# EAGLE design arduino_8i_8o_Shield (EAGLE 7.3.0)
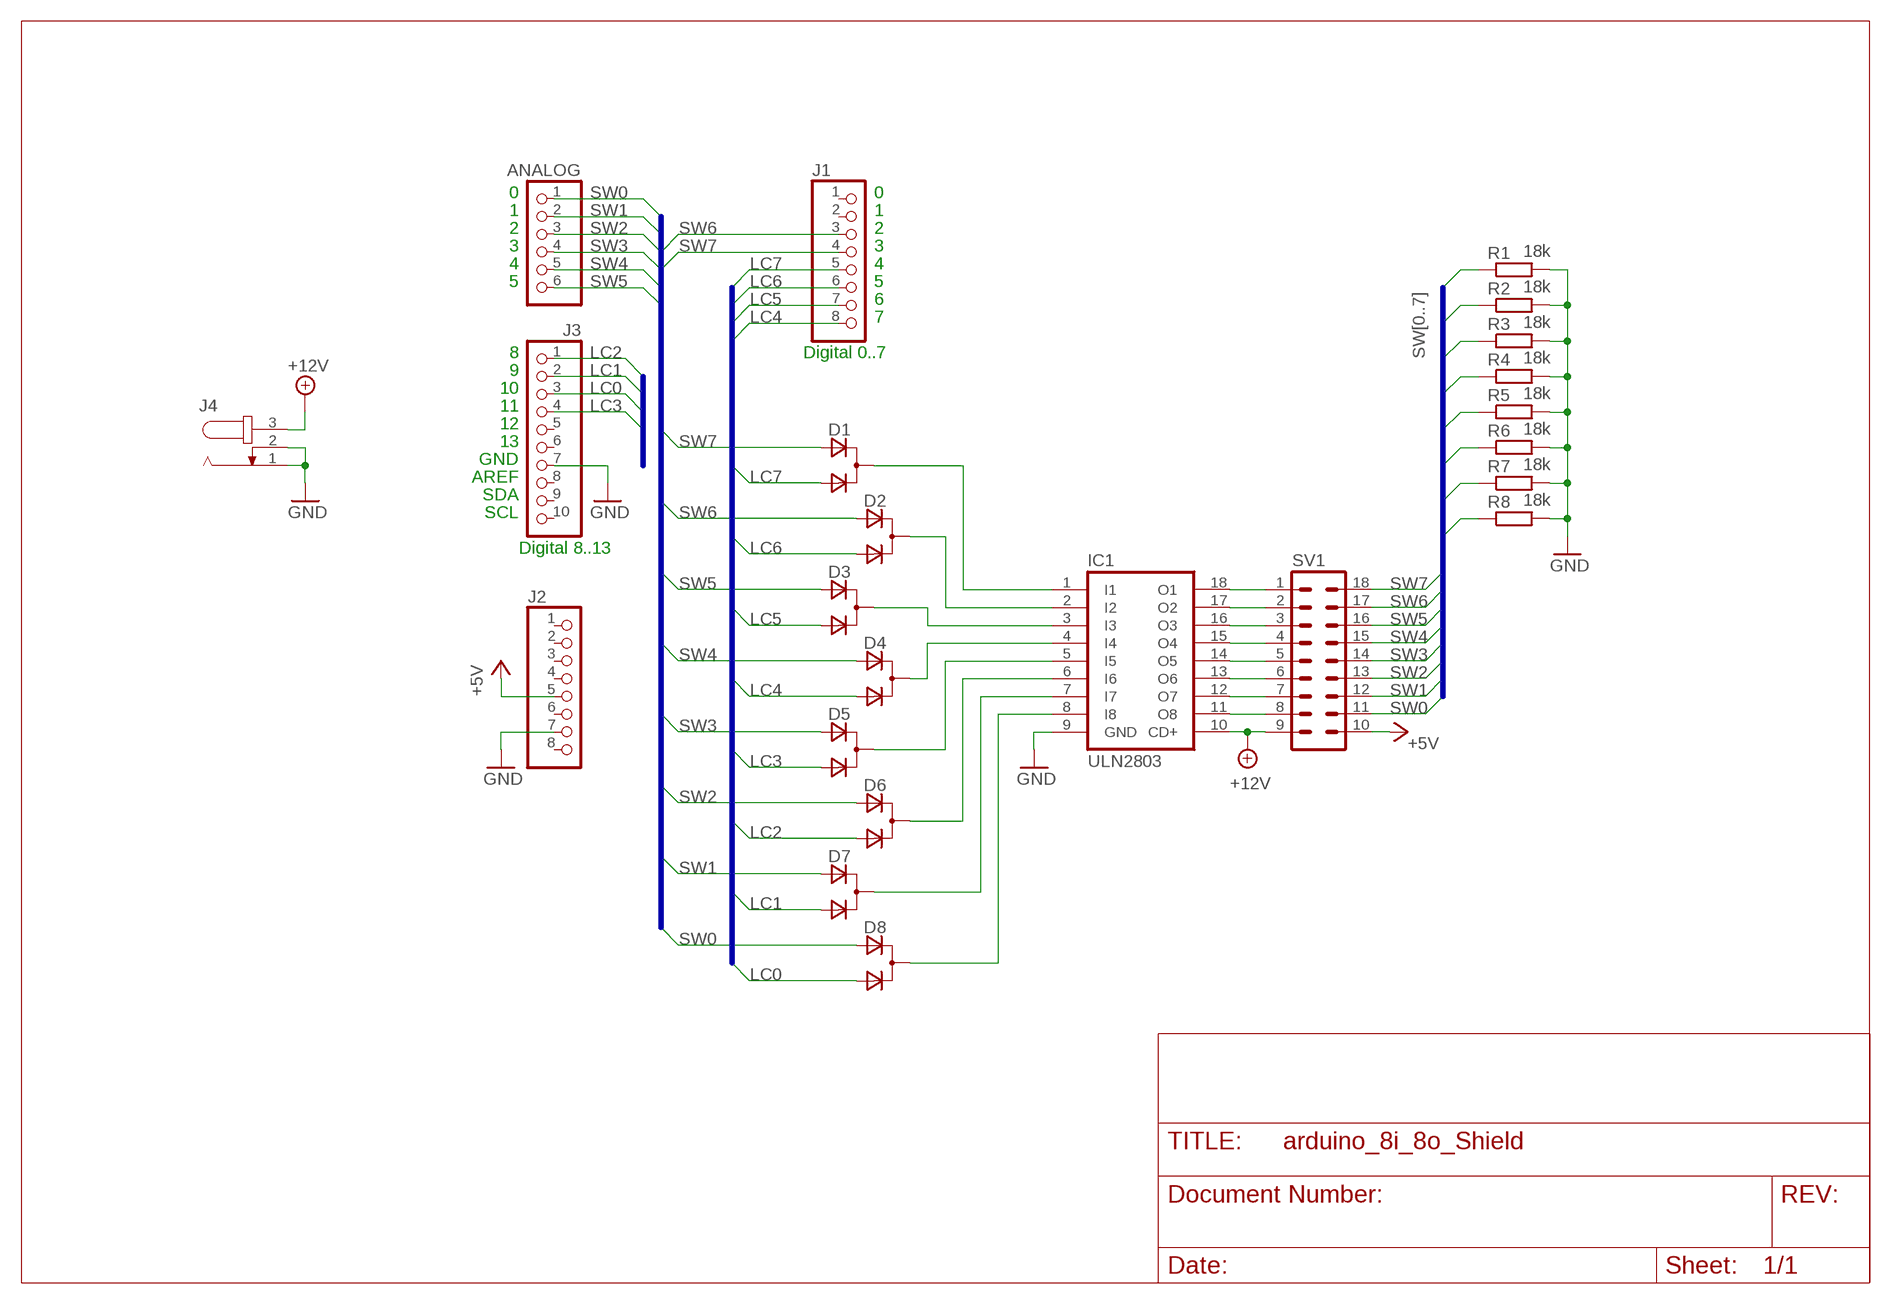
[diagram p0: schematic, sheet 1]

## Parts
ANALOG  PINHD-1X6  [1X06]
D1  VAR2_SOT23  [SOT-23]
D2  VAR2_SOT23  [SOT-23]
D3  VAR2_SOT23  [SOT-23]
D4  VAR2_SOT23  [SOT-23]
D5  VAR2_SOT23  [SOT-23]
D6  VAR2_SOT23  [SOT-23]
D7  VAR2_SOT23  [SOT-23]
D8  VAR2_SOT23  [SOT-23]
IC1  ULN2803  ULN2803A  [DIL18]
J1  PINHD-1X8TH  [1X08-TH]
J2  PINHD-1X8TH  [1X08-TH]
J3  PINHD-1X10TH  [1X10-TH]
J4  JACK-PLUG0  [SPC4077]
R1  18k  R-EU_M1206  [M1206]
R2  18k  R-EU_M1206  [M1206]
R3  18k  R-EU_M1206  [M1206]
R4  18k  R-EU_M1206  [M1206]
R5  18k  R-EU_M1206  [M1206]
R6  18k  R-EU_M1206  [M1206]
R7  18k  R-EU_M1206  [M1206]
R8  18k  R-EU_M1206  [M1206]
SV1  IC18PL  [IC18PL]

## Nets
+5V: J2.5 SV1.10
+12V: IC1.10(CD+) J4.3 SV1.9
GND: IC1.9(GND) J2.7 J3.7 J4.1 J4.2 R1.2 R2.2 R3.2 R4.2 R5.2 R6.2 R7.2 R8.2
LC0: D8.3(A2) J3.3
LC1: D7.3(A2) J3.2
LC2: D6.3(A2) J3.1
LC3: D5.3(A2) J3.4
LC4: D4.3(A2) J1.8
LC5: D3.3(A2) J1.7
LC6: D2.3(A2) J1.6
LC7: D1.3(A2) J1.5
N$1: IC1.11(O8) SV1.8
N$2: IC1.18(O1) SV1.1
N$3: IC1.17(O2) SV1.2
N$4: IC1.16(O3) SV1.3
N$5: IC1.15(O4) SV1.4
N$6: IC1.14(O5) SV1.5
N$7: IC1.13(O6) SV1.6
N$8: IC1.12(O7) SV1.7
N$9: D1.1(C) IC1.1(I1)
N$10: D2.1(C) IC1.2(I2)
N$11: D3.1(C) IC1.3(I3)
N$12: D4.1(C) IC1.4(I4)
N$13: D5.1(C) IC1.5(I5)
N$14: D6.1(C) IC1.6(I6)
N$15: D7.1(C) IC1.7(I7)
N$16: D8.1(C) IC1.8(I8)
SW0: ANALOG.1 D8.2(A1) R1.1 SV1.11
SW1: ANALOG.2 D7.2(A1) R2.1 SV1.12
SW2: ANALOG.3 D6.2(A1) R3.1 SV1.13
SW3: ANALOG.4 D5.2(A1) R4.1 SV1.14
SW4: ANALOG.5 D4.2(A1) R5.1 SV1.15
SW5: ANALOG.6 D3.2(A1) R6.1 SV1.16
SW6: D2.2(A1) J1.3 R7.1 SV1.17
SW7: D1.2(A1) J1.4 R8.1 SV1.18
Unconnected: J1.1 J1.2 J2.1 J2.2 J2.3 J2.4 J2.6 J2.8 J3.5 J3.6 J3.8 J3.9 J3.10

## Buses
SW[0..7]
LC[0..7]

## Notes on the sheet
- 0 | 0
- 1 | 1
- 2 | 2
- 3 | 3
- 4 | 4
- 5 | 5
- 6
- 7
- 8 | Digital 0..7
- 9
- 10
- 11
- 12
- 13
- GND
- AREF
- SDA
- SCL
- Digital 8..13

## Library data of the parts
ANALOG = pinhead:PINHD-1X6: PIN HEADER
D1-D8 = zetex:VAR2_SOT23: Dual DIODE; OC_FARNELL: unknown; OC_NEWARK: unknown
IC1 = uln-udn:ULN2803A: DRIVER ARRAY
J1 J2 = SmartPrj:PINHD-1X8: PIN HEADER
J3 = SmartPrj:PINHD-1X10: PIN HEADER
J4 = con-jack:JACK-PLUG: DC POWER JACK Power Jack, DC, Right Angle, Through Hole, Rated 5A at 16VDC, PC Terminals Distributor: Farnell (www.Farnell.de) Drawing: 84N1161.pdf / 84N1162.pdf Manufacturer: SPC Technology (www.spctechnology.com) Type: SPC4077 / SPC 4078; OC_FARNELL: unknown; OC_NEWARK: unknown
R1-R8 = rcl:R-EU_: RESISTOR, European symbol
SV1 = con-dil:IC18PL: DIL CABLE CONNECTOR

## Board
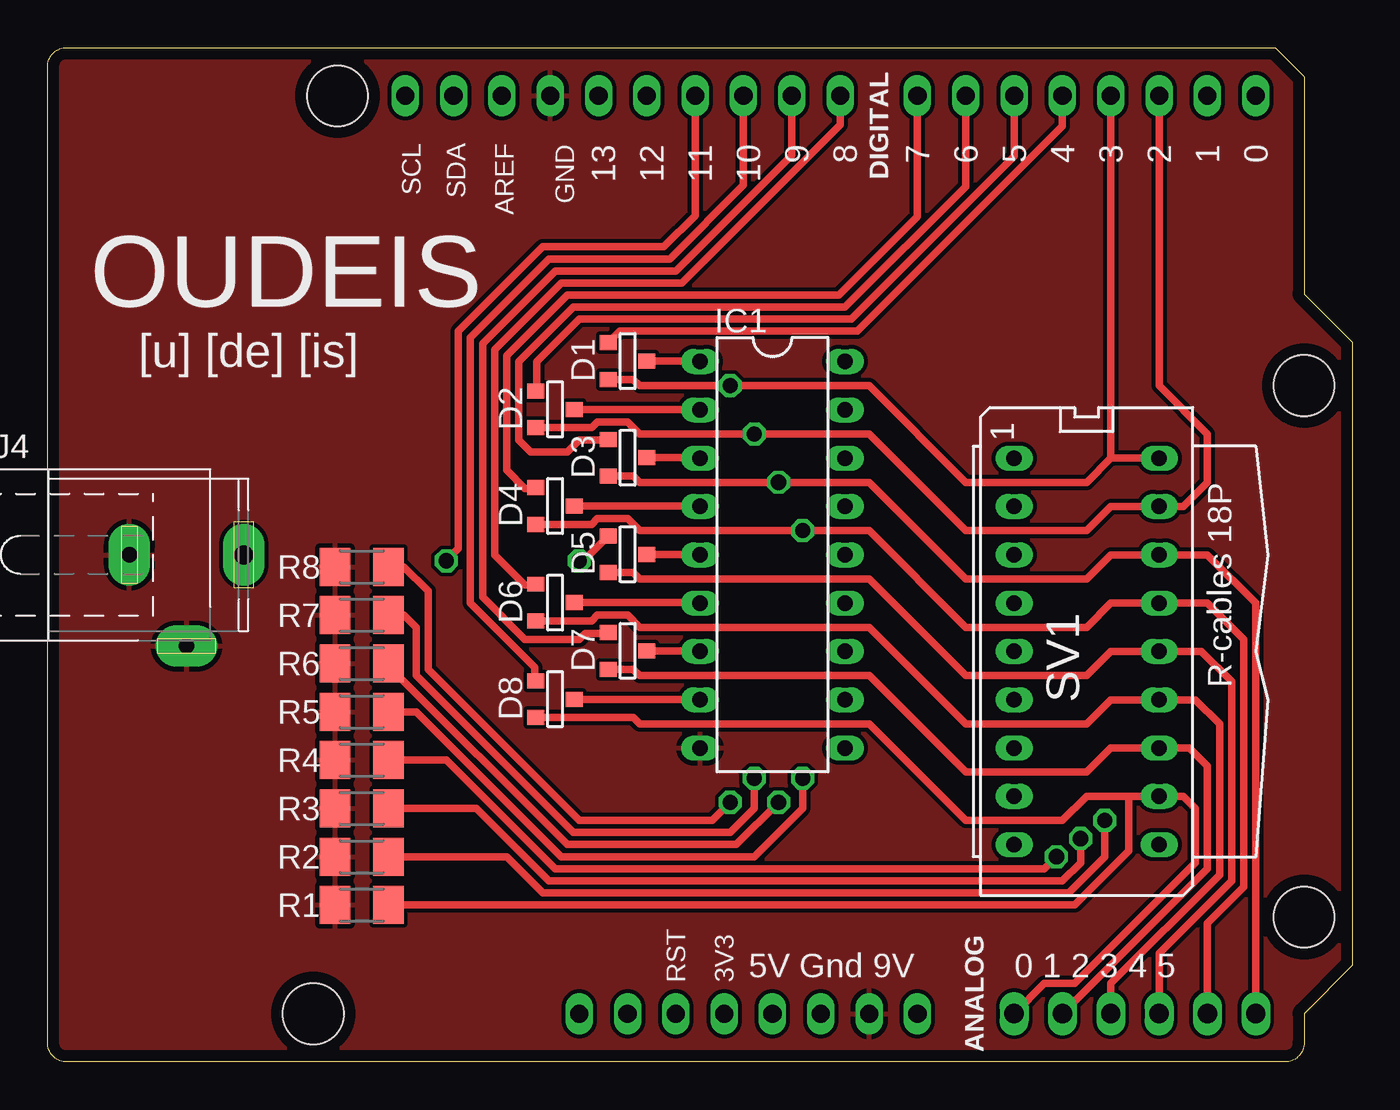
[diagram p1: board, top side]
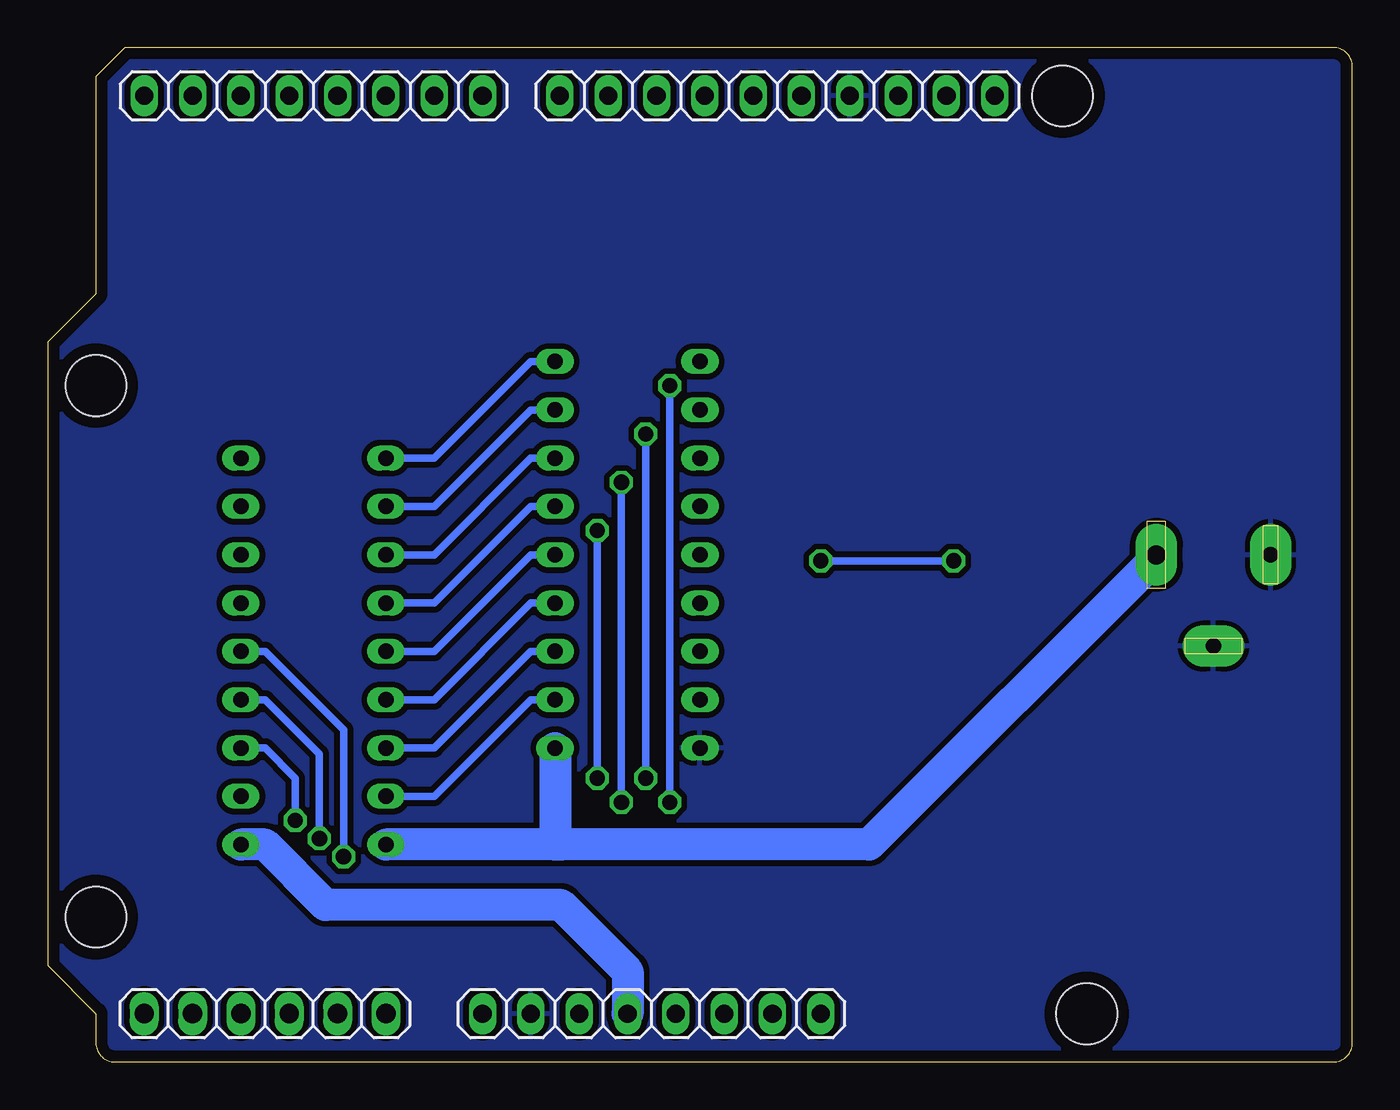
[diagram p2: board, bottom side, seen from below]

Size 68.58 x 53.34 mm. Coordinates in mm from the lower left corner, seen from the top.
Outline: 64.52,53.34 66.04,51.82 66.04,40.39 68.58,37.85 68.58,5.08 66.04,2.54 66.04,1 arc-90 65.04,0 1,0 arc-90 0,1 0,52.34 arc-90 1,53.34 64.52,53.34
Copper layers (1*16): Top 0.035mm / dielectric 1.5mm / Bottom 0.035mm
Design rules "default *": minimum track width 10mil, minimum drill 24mil, track to track 8mil, track to pad 8mil, pad to pad 8mil, via to via 8mil, smd to smd 8mil, copper to edge 24mil, drill to drill 8mil, minimum pad ring 10mil, minimum via ring 8mil, stop-mask expansion 2mil, vias tented up to drill 0mil, thermal gap 10mil
Holes 3.2 mm at 15.24,50.8 66.04,7.62 66.04,35.56 13.97,2.54

### Footprints (pad centres in the part's own frame; a part is rotated, then mirrored left to right if it is on the bottom)
1X06 = drill 1.016 long: 1 -6.35,0; 2 -3.81,0; 3 -1.27,0; 4 1.27,0; 5 3.81,0; 6 6.35,0
SOT-23 = smd 0.787 x 0.889: 1 0.025,-1.016; 2 -0.94,1.016; 3 0.991,1.016
DIL18 = drill 0.813 long: 1 -10.16,-3.81; 2 -7.62,-3.81; 3 -5.08,-3.81; 4 -2.54,-3.81; 5 0,-3.81; 6 2.54,-3.81; 7 5.08,-3.81; 8 7.62,-3.81; 9 10.16,-3.81; 10 10.16,3.81; 11 7.62,3.81; 12 5.08,3.81; 13 2.54,3.81; 14 0,3.81; 15 -2.54,3.81; 16 -5.08,3.81; 17 -7.62,3.81; 18 -10.16,3.81
1X08-TH = drill 0.95 pad 1.422 long: 1 -8.89,0; 2 -6.35,0; 3 -3.81,0; 4 -1.27,0; 5 1.27,0; 6 3.81,0; 7 6.35,0; 8 8.89,0
1X10-TH = drill 0.95 pad 1.422 long: 1 -11.43,0; 2 -8.89,0; 3 -6.35,0; 4 -3.81,0; 5 -1.27,0; 6 1.27,0; 7 3.81,0; 8 6.35,0; 9 8.89,0; 10 11.43,0
SPC4077 = drill 0.8 pad 2.184 long: 1 -3,0; 2 0,-4.8 | drill 1 pad 2.184 long: 3 3,0
M1206 = smd 1.6 x 2: 1 -1.4,0; 2 1.4,0
IC18PL = drill 0.813 long: 1 -10.16,-3.81; 2 -7.62,-3.81; 3 -5.08,-3.81; 4 -2.54,-3.81; 5 0,-3.81; 6 2.54,-3.81; 7 5.08,-3.81; 8 7.62,-3.81; 9 10.16,-3.81; 10 10.16,3.81; 11 7.62,3.81; 12 5.08,3.81; 13 2.54,3.81; 14 0,3.81; 15 -2.54,3.81; 16 -5.08,3.81; 17 -7.62,3.81; 18 -10.16,3.81

### Placement (x,y rotation side)
ANALOG  57.15,2.54 180 bottom
D1  30.48,36.83 90 top
D2  26.67,34.29 90 top
D3  30.48,31.75 90 top
D4  26.67,29.21 90 top
D5  30.48,26.67 90 top
D6  26.67,24.13 90 top
D7  30.48,21.59 90 top
D8  26.67,19.05 90 top
IC1  38.1,26.67 270 top
J1  54.61,50.8 0 bottom
J2  36.83,2.54 180 bottom
J3  30.23,50.8 0 bottom
J4  7.3,26.67 0 top
R1  16.51,8.26 180 top
R2  16.51,10.79 180 top
R3  16.51,13.34 180 top
R4  16.51,15.88 180 top
R5  16.51,18.41 180 top
R6  16.51,20.95 180 top
R7  16.51,23.5 180 top
R8  16.51,26.04 180 top
SV1  54.61,21.59 270 top

### Tracks (layer width: path | path; a pad name or v marks a point on that pad's centre or on a via)
+5V
  Bottom 1.676: SV1.10 57.15,11.43 53.98,8.26 41.59,8.26 38.1,4.76 J2.5
+12V
  Bottom 1.676: SV1.9 41.91,11.43 41.91,11.75 | IC1.10 41.91,11.75 | J4.3 10.16,26.67 25.4,11.43 41.59,11.43 41.91,11.75
GND
  pour Bottom (isolate 0.305): 0,53.34 68.58,53.34 68.58,0 0,0
  pour Top: 0,53.34 68.58,53.34 68.58,0 0,0
LC0
  Top 0.406: D8.3 25.62,20 25.62,20.74 22.23,24.13 22.23,38.1 26.35,42.23 32.7,42.23 36.58,46.1 J3.3
LC1
  Top 0.406: J3.2 39.12,47.69 33.02,41.59 26.67,41.59 22.86,37.78 22.86,24.45 25.08,22.23 27.94,22.23 28.26,22.54 29.43,22.54 D7.3
LC2
  Top 0.406: J3.1 41.66,49.28 33.34,40.96 26.99,40.96 23.5,37.47 23.5,26.67 25.08,25.08 25.62,25.08 D6.3
LC3  (via drill 0.8)
  Top 0.406: J3.4 34.04,44.51 32.38,42.86 26.04,42.86 21.59,38.42 21.59,26.99 v20.95,26.35 | v27.94,26.35 28.16,26.35 D5.3
  Bottom 0.406: v20.95,26.35 v27.94,26.35
LC4
  Top 0.406: D4.3 25.62,30.16 25.08,30.16 24.13,31.11 24.13,37.15 27.3,40.32 41.59,40.32 45.72,44.45 J1.8
LC5
  Top 0.406: D3.3 29.43,32.7 27.94,32.7 27.3,32.07 25.4,32.07 24.77,32.7 24.77,36.83 27.62,39.69 41.91,39.69 48.26,46.04 J1.7
LC6
  Top 0.406: J1.6 50.8,47.62 42.23,39.05 27.94,39.05 25.72,36.83 25.72,35.34 D2.3
LC7
  Top 0.406: D1.3 30.06,38.42 42.55,38.42 53.34,49.21 J1.5
N$1
  Bottom 0.406: IC1.11 43.18,19.05 48.26,13.97 SV1.8
N$2
  Bottom 0.406: IC1.18 43.18,36.83 48.26,31.75 SV1.1
N$3
  Bottom 0.406: IC1.17 43.18,34.29 48.26,29.21 SV1.2
N$4
  Bottom 0.406: IC1.16 43.18,31.75 48.26,26.67 SV1.3
N$5
  Bottom 0.406: IC1.15 43.18,29.21 48.26,24.13 SV1.4
N$6
  Bottom 0.406: IC1.14 43.18,26.67 48.26,21.59 SV1.5
N$7
  Bottom 0.406: IC1.13 43.18,24.13 48.26,19.05 SV1.6
N$8
  Bottom 0.406: IC1.12 43.18,21.59 48.26,16.51 SV1.7
N$9
  Top 0.406: D1.1 34.29,36.85 IC1.1
N$10
  Top 0.406: D2.1 34.29,34.31 IC1.2
N$11
  Top 0.406: D3.1 34.29,31.77 IC1.3
N$12
  Top 0.406: D4.1 34.29,29.23 IC1.4
N$13
  Top 0.406: D5.1 34.29,26.7 IC1.5
N$14
  Top 0.406: D6.1 34.29,24.16 IC1.6
N$15
  Top 0.406: D7.1 34.29,21.61 IC1.7
N$16
  Top 0.406: D8.1 34.29,19.07 IC1.8
SW0
  Top 0.406: D8.2 30.79,18.11 31.11,17.78 43.18,17.78 48.26,12.7 53.34,12.7 54.61,13.97 56.83,13.97 | 56.83,13.97 SV1.11 59.69,13.97 60.33,13.34 60.33,10.48 53.98,4.13 52.39,4.13 ANALOG.1 | R1.1 53.98,8.26 56.83,11.11 56.83,13.97
SW1  (via drill 0.8)
  Top 0.406: D7.2 30.79,20.65 31.11,20.32 43.18,20.32 48.26,15.24 54.61,15.24 55.88,16.51 SV1.12 60.01,16.51 60.96,15.56 60.96,10.16 ANALOG.2 | R2.1 24.13,10.79 26.04,8.89 53.66,8.89 55.56,10.79 v55.56,12.7
  Bottom 0.406: v55.56,12.7 55.56,14.92 57.15,16.51 SV1.12
SW2  (via drill 0.8)
  Top 0.406: D6.2 28.59,23.19 28.89,23.5 30.48,23.5 31.11,22.86 43.18,22.86 48.26,17.78 54.61,17.78 55.88,19.05 SV1.13 60.33,19.05 61.59,17.78 61.59,9.84 55.88,4.13 ANALOG.3 | R3.1 22.54,13.34 26.35,9.53 53.34,9.53 54.29,10.48 v54.29,11.75
  Bottom 0.406: v54.29,11.75 54.29,16.19 57.15,19.05 SV1.13
SW3  (via drill 0.8)
  Top 0.406: D5.2 30.79,25.73 31.11,25.4 43.18,25.4 48.26,20.32 54.61,20.32 55.88,21.59 SV1.14 60.64,21.59 62.23,20 62.23,9.53 58.42,5.71 ANALOG.4 | R4.1 20.95,15.88 26.67,10.16 52.39,10.16 v53.02,10.79
  Bottom 0.406: v53.02,10.79 53.02,17.46 57.15,21.59 SV1.14
SW4  (via drill 0.8)
  Top 0.406: D4.2 28.59,28.27 28.89,28.57 30.48,28.57 31.11,27.94 v39.69,27.94 43.18,27.94 48.26,22.86 54.61,22.86 55.88,24.13 SV1.15 60.96,24.13 62.87,22.23 62.87,9.21 60.96,7.3 ANALOG.5 | R5.1 19.37,18.41 26.99,10.79 37.15,10.79 39.69,13.34 v39.69,14.92
  Bottom 0.406: v39.69,14.92 v39.69,27.94
SW5  (via drill 0.8)
  Top 0.406: D3.2 30.79,30.81 31.11,30.48 v38.42,30.48 43.18,30.48 48.26,25.4 54.61,25.4 55.88,26.67 SV1.16 60.96,26.67 63.5,24.13 ANALOG.6 | R6.1 17.91,20.82 27.3,11.43 36.2,11.43 v38.42,13.65
  Bottom 0.406: v38.42,13.65 v38.42,30.48
SW6  (via drill 0.8)
  Top 0.406: D2.2 28.59,33.35 28.89,33.66 30.48,33.66 31.11,33.02 v37.15,33.02 43.18,33.02 48.26,27.94 54.61,27.94 55.88,29.21 SV1.17 59.69,29.21 60.96,30.48 60.96,33.02 58.42,35.56 J1.3 | R7.1 18.73,23.5 19.37,22.86 19.37,20.32 27.62,12.06 35.88,12.06 37.15,13.34 v37.15,14.92
  Bottom 0.406: v37.15,14.92 v37.15,33.02
SW7  (via drill 0.8)
  Top 0.406: D1.2 30.79,35.89 31.11,35.56 v35.88,35.56 43.18,35.56 48.26,30.48 54.61,30.48 55.88,31.75 | 55.88,31.75 SV1.18 | 55.88,31.75 J1.4 | R8.1 18.73,26.04 20,24.77 20,20.64 27.94,12.7 34.92,12.7 v35.88,13.65
  Bottom 0.406: v35.88,13.65 v35.88,35.56

### Text on the board
tPlace: 13 | 12 | 11 | 10 | 9 | 8 | 7 | 6 | 5 | 4 | 3 | 2 | 1 | 0 | OUDEIS | [u] [de] [is]
tNames: DIGITAL | SCL | SDA | AREF | GND | RST | 3V3 | 5V Gnd 9V | 0 1 2 3 4 5